# EAGLE schematic a3640 (EAGLE 7.7.0)

## Sheet 1 of 3
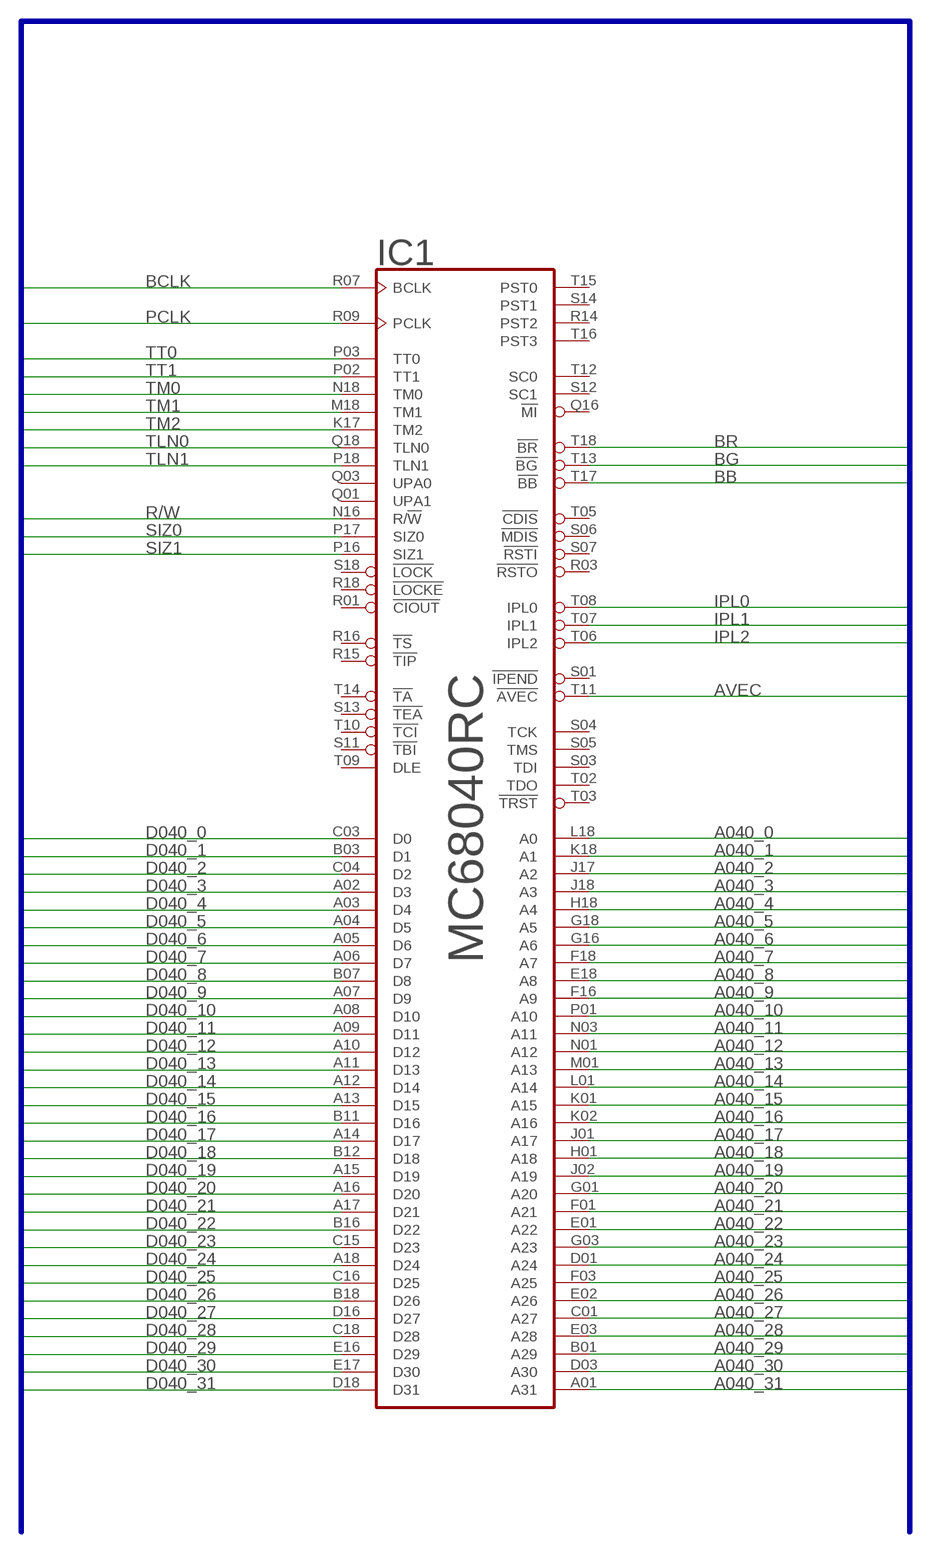
[diagram p0: schematic, sheet 1]

### Parts
IC1  MC68040RC  [MPGA-179]

### Nets
A040_0: IC1.L18(A0)
A040_1: IC1.K18(A1)
A040_2: IC1.J17(A2)
A040_3: IC1.J18(A3)
A040_4: IC1.H18(A4)
A040_5: IC1.G18(A5)
A040_6: IC1.G16(A6)
A040_7: IC1.F18(A7)
A040_8: IC1.E18(A8)
A040_9: IC1.F16(A9)
A040_10: IC1.P01(A10)
A040_11: IC1.N03(A11)
A040_12: IC1.N01(A12)
A040_13: IC1.M01(A13)
A040_14: IC1.L01(A14)
A040_15: IC1.K01(A15)
A040_16: IC1.K02(A16)
A040_17: IC1.J01(A17)
A040_18: IC1.H01(A18)
A040_19: IC1.J02(A19)
A040_20: IC1.G01(A20)
A040_21: IC1.F01(A21)
A040_22: IC1.E01(A22)
A040_23: IC1.G03(A23)
A040_24: IC1.D01(A24)
A040_25: IC1.F03(A25)
A040_26: IC1.E02(A26)
A040_27: IC1.C01(A27)
A040_28: IC1.E03(A28)
A040_29: IC1.B01(A29)
A040_30: IC1.D03(A30)
A040_31: IC1.A01(A31)
AVEC: IC1.T11(!AVEC)
BB: IC1.T17(!BB)
BCLK: IC1.R07(BCLK)
BG: IC1.T13(!BG)
BR: IC1.T18(!BR)
D040_0: IC1.C03(D0) ; also sheet 2
D040_1: IC1.B03(D1) ; also sheet 2
D040_2: IC1.C04(D2) ; also sheet 2
D040_3: IC1.A02(D3) ; also sheet 2
D040_4: IC1.A03(D4) ; also sheet 2
D040_5: IC1.A04(D5) ; also sheet 2
D040_6: IC1.A05(D6) ; also sheet 2
D040_7: IC1.A06(D7) ; also sheet 2
D040_8: IC1.B07(D8) ; also sheet 2
D040_9: IC1.A07(D9) ; also sheet 2
D040_10: IC1.A08(D10) ; also sheet 2
D040_11: IC1.A09(D11) ; also sheet 2
D040_12: IC1.A10(D12) ; also sheet 2
D040_13: IC1.A11(D13) ; also sheet 2
D040_14: IC1.A12(D14) ; also sheet 2
D040_15: IC1.A13(D15) ; also sheet 2
D040_16: IC1.B11(D16) ; also sheet 2
D040_17: IC1.A14(D17) ; also sheet 2
D040_18: IC1.B12(D18) ; also sheet 2
D040_19: IC1.A15(D19) ; also sheet 2
D040_20: IC1.A16(D20) ; also sheet 2
D040_21: IC1.A17(D21) ; also sheet 2
D040_22: IC1.B16(D22) ; also sheet 2
D040_23: IC1.C15(D23) ; also sheet 2
D040_24: IC1.A18(D24) ; also sheet 2
D040_25: IC1.C16(D25) ; also sheet 2
D040_26: IC1.B18(D26) ; also sheet 2
D040_27: IC1.D16(D27) ; also sheet 2
D040_28: IC1.C18(D28) ; also sheet 2
D040_29: IC1.E16(D29) ; also sheet 2
D040_30: IC1.E17(D30) ; also sheet 2
D040_31: IC1.D18(D31) ; also sheet 2
IPL0: IC1.T08(IPL0)
IPL1: IC1.T07(IPL1)
IPL2: IC1.T06(IPL2)
PCLK: IC1.R09(PCLK)
R/W: IC1.N16(R/!W)
SIZ0: IC1.P17(SIZ0)
SIZ1: IC1.P16(SIZ1)
TLN0: IC1.Q18(TLN0)
TLN1: IC1.P18(TLN1)
TM0: IC1.N18(TM0)
TM1: IC1.M18(TM1)
TM2: IC1.K17(TM2)
TT0: IC1.P03(TT0)
TT1: IC1.P02(TT1)
Unconnected: IC1.Q01(UPA1) IC1.Q03(UPA0) IC1.Q16(!MI) IC1.R01(!CIOUT) IC1.R03(!RSTO) IC1.R14(PST2) IC1.R15(!TIP) IC1.R16(!TS) IC1.R18(!LOCKE) IC1.S01(!IPEND) IC1.S03(TDI) IC1.S04(TCK) IC1.S05(TMS) IC1.S06(!MDIS) IC1.S07(!RSTI) IC1.S11(!TBI) IC1.S12(SC1) IC1.S13(!TEA) IC1.S14(PST1) IC1.S18(!LOCK) IC1.T02(TDO) IC1.T03(!TRST) IC1.T05(!CDIS) IC1.T09(DLE) IC1.T10(!TCI) IC1.T12(SC0) IC1.T14(!TA) IC1.T15(PST0) IC1.T16(PST3)

### Buses
VCC,GND,D040_[0..31],A040_[0..31],IPL[0..2],BR,BG,BB,BCLK,PCLK,TT[0..1],TM[0..2],TLN[0..1],SIZ[0..1],R/W,AVEC

## Sheet 2 of 3
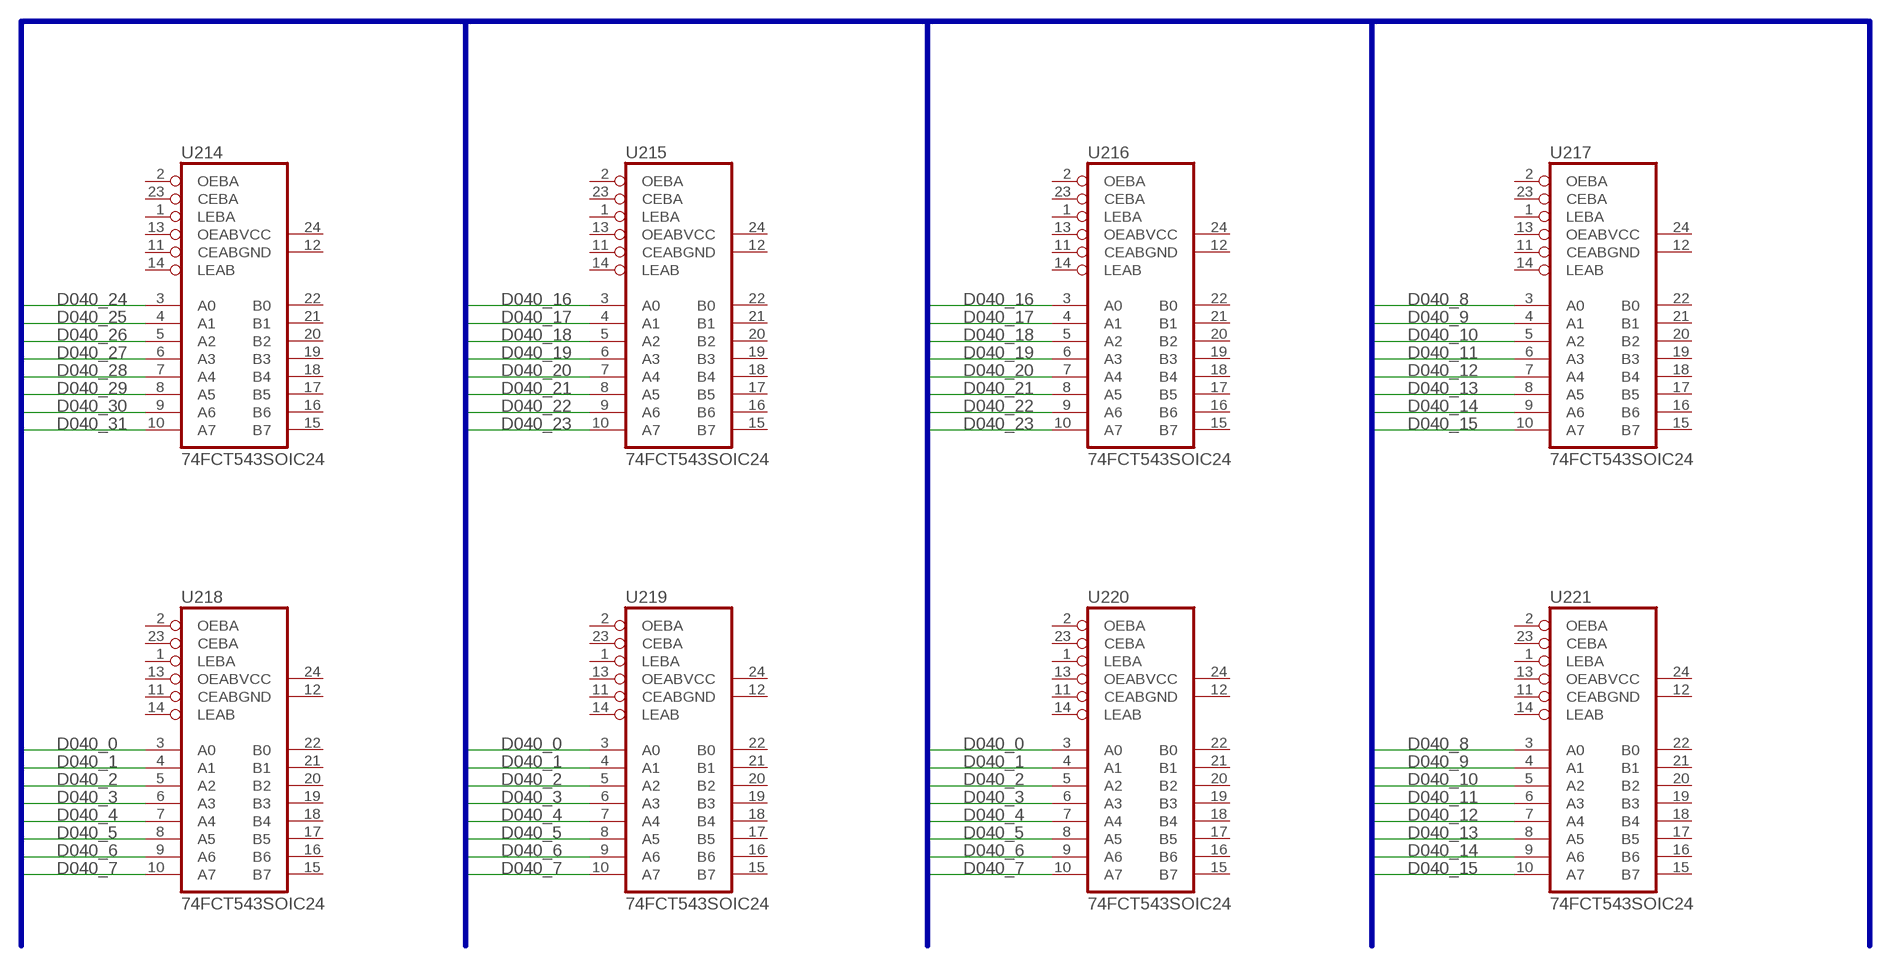
[diagram p1: schematic, sheet 2]

### Parts
U214  74FCT543SOIC24  [74FCT543A]
U215  74FCT543SOIC24  [74FCT543A]
U216  74FCT543SOIC24  [74FCT543A]
U217  74FCT543SOIC24  [74FCT543A]
U218  74FCT543SOIC24  [74FCT543A]
U219  74FCT543SOIC24  [74FCT543A]
U220  74FCT543SOIC24  [74FCT543A]
U221  74FCT543SOIC24  [74FCT543A]

### Nets
D040_0: U218.3(A0) U219.3(A0) U220.3(A0) ; also sheet 1
D040_1: U218.4(A1) U219.4(A1) U220.4(A1) ; also sheet 1
D040_2: U218.5(A2) U219.5(A2) U220.5(A2) ; also sheet 1
D040_3: U218.6(A3) U219.6(A3) U220.6(A3) ; also sheet 1
D040_4: U218.7(A4) U219.7(A4) U220.7(A4) ; also sheet 1
D040_5: U218.8(A5) U219.8(A5) U220.8(A5) ; also sheet 1
D040_6: U218.9(A6) U219.9(A6) U220.9(A6) ; also sheet 1
D040_7: U218.10(A7) U219.10(A7) U220.10(A7) ; also sheet 1
D040_8: U217.3(A0) U221.3(A0) ; also sheet 1
D040_9: U217.4(A1) U221.4(A1) ; also sheet 1
D040_10: U217.5(A2) U221.5(A2) ; also sheet 1
D040_11: U217.6(A3) U221.6(A3) ; also sheet 1
D040_12: U217.7(A4) U221.7(A4) ; also sheet 1
D040_13: U217.8(A5) U221.8(A5) ; also sheet 1
D040_14: U217.9(A6) U221.9(A6) ; also sheet 1
D040_15: U217.10(A7) U221.10(A7) ; also sheet 1
D040_16: U215.3(A0) U216.3(A0) ; also sheet 1
D040_17: U215.4(A1) U216.4(A1) ; also sheet 1
D040_18: U215.5(A2) U216.5(A2) ; also sheet 1
D040_19: U215.6(A3) U216.6(A3) ; also sheet 1
D040_20: U215.7(A4) U216.7(A4) ; also sheet 1
D040_21: U215.8(A5) U216.8(A5) ; also sheet 1
D040_22: U215.9(A6) U216.9(A6) ; also sheet 1
D040_23: U215.10(A7) U216.10(A7) ; also sheet 1
D040_24: U214.3(A0) ; also sheet 1
D040_25: U214.4(A1) ; also sheet 1
D040_26: U214.5(A2) ; also sheet 1
D040_27: U214.6(A3) ; also sheet 1
D040_28: U214.7(A4) ; also sheet 1
D040_29: U214.8(A5) ; also sheet 1
D040_30: U214.9(A6) ; also sheet 1
D040_31: U214.10(A7) ; also sheet 1
Unconnected: U214.1(LEBA) U214.2(OEBA) U214.11(CEAB) U214.13(OEAB) U214.14(LEAB) U214.15(B7) U214.16(B6) U214.17(B5) U214.18(B4) U214.19(B3) U214.20(B2) U214.21(B1) U214.22(B0) U214.23(CEBA) U215.1(LEBA) U215.2(OEBA) U215.11(CEAB) U215.13(OEAB) U215.14(LEAB) U215.15(B7) U215.16(B6) U215.17(B5) U215.18(B4) U215.19(B3) U215.20(B2) U215.21(B1) U215.22(B0) U215.23(CEBA) U216.1(LEBA) U216.2(OEBA) U216.11(CEAB) U216.13(OEAB) U216.14(LEAB) U216.15(B7) U216.16(B6) U216.17(B5) U216.18(B4) U216.19(B3) U216.20(B2) U216.21(B1) U216.22(B0) U216.23(CEBA) U217.1(LEBA) U217.2(OEBA) U217.11(CEAB) U217.13(OEAB) U217.14(LEAB) U217.15(B7) U217.16(B6) U217.17(B5) U217.18(B4) U217.19(B3) U217.20(B2) U217.21(B1) U217.22(B0) U217.23(CEBA) U218.1(LEBA) U218.2(OEBA) U218.11(CEAB) U218.13(OEAB) U218.14(LEAB) U218.15(B7) U218.16(B6) U218.17(B5) U218.18(B4) U218.19(B3) U218.20(B2) U218.21(B1) U218.22(B0) U218.23(CEBA) U219.1(LEBA) U219.2(OEBA) U219.11(CEAB) U219.13(OEAB) U219.14(LEAB) U219.15(B7) U219.16(B6) U219.17(B5) U219.18(B4) U219.19(B3) U219.20(B2) U219.21(B1) U219.22(B0) U219.23(CEBA) U220.1(LEBA) U220.2(OEBA) U220.11(CEAB) U220.13(OEAB) U220.14(LEAB) U220.15(B7) U220.16(B6) U220.17(B5) U220.18(B4) U220.19(B3) U220.20(B2) U220.21(B1) U220.22(B0) U220.23(CEBA) U221.1(LEBA) U221.2(OEBA) U221.11(CEAB) U221.13(OEAB) U221.14(LEAB) U221.15(B7) U221.16(B6) U221.17(B5) U221.18(B4) U221.19(B3) U221.20(B2) U221.21(B1) U221.22(B0) U221.23(CEBA)

### Buses
VCC,GND,D[0..31],D040_[0..31],A040_[0..31],IPL[0..2],BR,BG,BB,BCLK,PCLK,TT[0..1],TM[0..2],TLN[0..1],SIZ[0..1],R/W,AVEC,LEBUS[0..7]

## Sheet 3 of 3
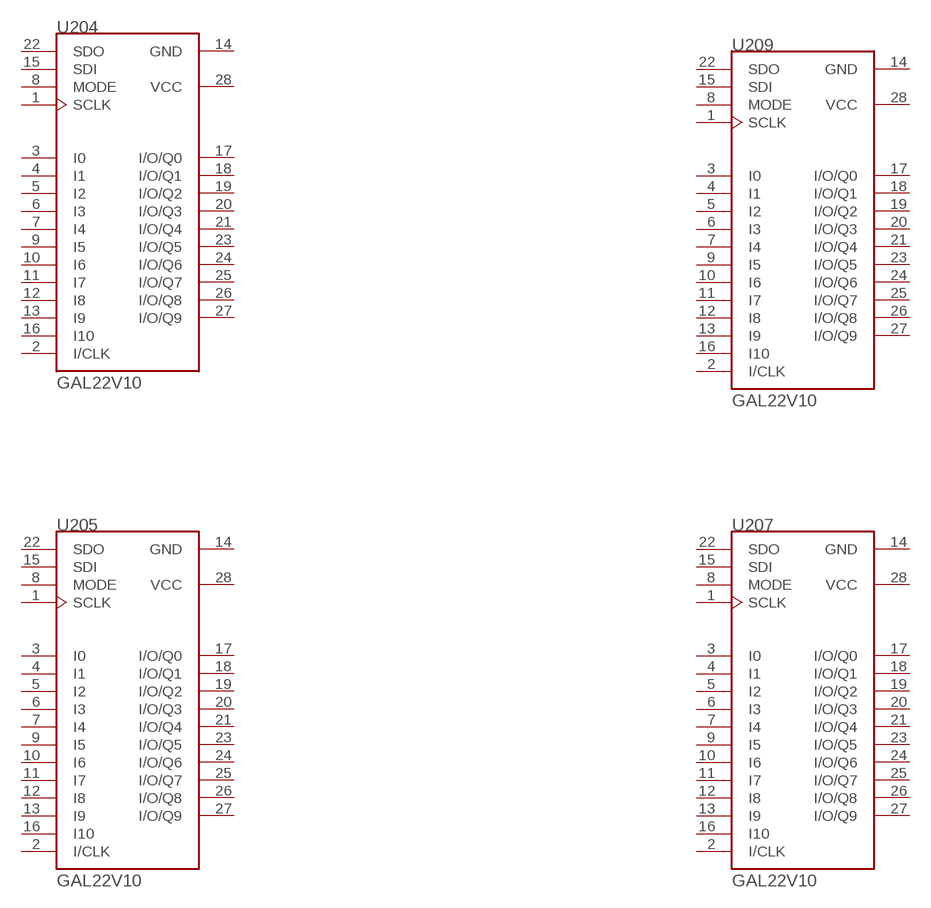
[diagram p2: schematic, sheet 3]

### Parts
U204  GAL22V10  [GAL22V10]
U205  GAL22V10  [GAL22V10]
U207  GAL22V10  [GAL22V10]
U209  GAL22V10  [GAL22V10]
Unconnected: U204.1(SCLK) U204.2(I/CLK) U204.3(I0) U204.4(I1) U204.5(I2) U204.6(I3) U204.7(I4) U204.8(MODE) U204.9(I5) U204.10(I6) U204.11(I7) U204.12(I8) U204.13(I9) U204.14(GND) U204.15(SDI) U204.16(I10) U204.17(I/O/Q0) U204.18(I/O/Q1) U204.19(I/O/Q2) U204.20(I/O/Q3) U204.21(I/O/Q4) U204.22(SDO) U204.23(I/O/Q5) U204.24(I/O/Q6) U204.25(I/O/Q7) U204.26(I/O/Q8) U204.27(I/O/Q9) U204.28(VCC) U205.1(SCLK) U205.2(I/CLK) U205.3(I0) U205.4(I1) U205.5(I2) U205.6(I3) U205.7(I4) U205.8(MODE) U205.9(I5) U205.10(I6) U205.11(I7) U205.12(I8) U205.13(I9) U205.14(GND) U205.15(SDI) U205.16(I10) U205.17(I/O/Q0) U205.18(I/O/Q1) U205.19(I/O/Q2) U205.20(I/O/Q3) U205.21(I/O/Q4) U205.22(SDO) U205.23(I/O/Q5) U205.24(I/O/Q6) U205.25(I/O/Q7) U205.26(I/O/Q8) U205.27(I/O/Q9) U205.28(VCC) U207.1(SCLK) U207.2(I/CLK) U207.3(I0) U207.4(I1) U207.5(I2) U207.6(I3) U207.7(I4) U207.8(MODE) U207.9(I5) U207.10(I6) U207.11(I7) U207.12(I8) U207.13(I9) U207.14(GND) U207.15(SDI) U207.16(I10) U207.17(I/O/Q0) U207.18(I/O/Q1) U207.19(I/O/Q2) U207.20(I/O/Q3) U207.21(I/O/Q4) U207.22(SDO) U207.23(I/O/Q5) U207.24(I/O/Q6) U207.25(I/O/Q7) U207.26(I/O/Q8) U207.27(I/O/Q9) U207.28(VCC) U209.1(SCLK) U209.2(I/CLK) U209.3(I0) U209.4(I1) U209.5(I2) U209.6(I3) U209.7(I4) U209.8(MODE) U209.9(I5) U209.10(I6) U209.11(I7) U209.12(I8) U209.13(I9) U209.14(GND) U209.15(SDI) U209.16(I10) U209.17(I/O/Q0) U209.18(I/O/Q1) U209.19(I/O/Q2) U209.20(I/O/Q3) U209.21(I/O/Q4) U209.22(SDO) U209.23(I/O/Q5) U209.24(I/O/Q6) U209.25(I/O/Q7) U209.26(I/O/Q8) U209.27(I/O/Q9) U209.28(VCC)

## Power pins joined to a net without a drawn wire
GND: IC1.B02(GND) IC1.B04(GND) IC1.B06(GND) IC1.B08(GND) IC1.B10(GND) IC1.B13(GND) IC1.B15(GND) IC1.B17(GND) IC1.C06(GND) IC1.C07(GND) IC1.C09(GND) IC1.C11(GND) IC1.C13(GND) IC1.D02(GND) IC1.D17(GND) IC1.F02(GND) IC1.F17(GND) IC1.H02(GND) IC1.H17(GND) IC1.K03(GND) IC1.K16(GND) IC1.L02(GND) IC1.L03(GND) IC1.L17(GND) IC1.M16(GND) IC1.N02(GND) IC1.N17(GND) IC1.Q02(GND) IC1.Q17(GND) IC1.R04(GND) IC1.R06(GND) IC1.R10(GND) IC1.R11(GND) IC1.R13(GND) IC1.S02(GND) IC1.S09(GND) IC1.S10(GND) IC1.S15(GND) IC1.S17(GND) IC1.T04(GND) U214.12(GND) U215.12(GND) U216.12(GND) U217.12(GND) U218.12(GND) U219.12(GND) U220.12(GND) U221.12(GND)
VCC: IC1.B05(VCC) IC1.B09(VCC) IC1.B14(VCC) IC1.C02(VCC) IC1.C05(VCC) IC1.C08(VCC) IC1.C10(VCC) IC1.C12(VCC) IC1.C14(VCC) IC1.C17(VCC) IC1.G02(VCC) IC1.G17(VCC) IC1.H03(VCC) IC1.H16(VCC) IC1.J03(VCC) IC1.J16(VCC) IC1.L16(VCC) IC1.M02(VCC) IC1.M03(VCC) IC1.M17(VCC) IC1.R02(VCC) IC1.R05(VCC) IC1.R08(VCC) IC1.R12(VCC) IC1.R17(VCC) IC1.S08(VCC) IC1.S16(VCC) U214.24(VCC) U215.24(VCC) U216.24(VCC) U217.24(VCC) U218.24(VCC) U219.24(VCC) U220.24(VCC) U221.24(VCC)

## Library data of the parts
IC1 = MC68K:MC68040RC: 68040 PROCESSOR
U204 U205 U207 U209 = a3640_edu_v0.1:GAL22V10: GAL22V10 PARA A3640
U214-U221 = terriblefire:74FCT543